# Altium schematic sheet Transistor_LED.SchDoc: LED with Transistor
size 203 x 127 mm; Author: Kace Chandler; DrawnBy: Kace Chandler; DocumentNumber: 21; Revision: 1; SheetNumber: 21; SheetTotal: 23
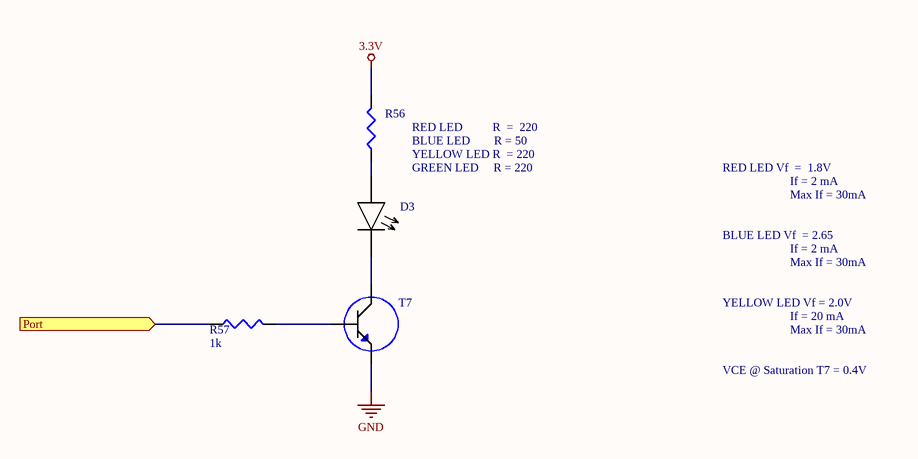
[diagram p0: Transistor_LED.SchDoc]

## Parts
D3  LED_R  [0402 footprint]  (value not drawn)
R56  Res3  (value not drawn)
R57  value 1k  (hidden comment: Res3)
T7  MMBT2222ALT1  [BJT]  (value not drawn)

## Ports
Port (in)

## Nets
3.3V: R56.2
GND: T7.2(E)
Port: R57.1 ; port Port
NetD3_1: D3.1 R56.1
NetD3_2: D3.2 T7.3(C)
NetR57_2: R57.2 T7.1(B)

## Notes on the sheet
- (near R56) RED LED          R  =  220
- (near R56) BLUE LED        R = 50
- YELLOW LED R  = 220
- GREEN LED     R = 220
- RED LED Vf  =  1.8V
- If = 2 mA
- Max If = 30mA
- BLUE LED Vf  = 2.65
- YELLOW LED Vf = 2.0V
- If = 20 mA
- VCE @ Saturation T7 = 0.4V

## Library data of the parts
R56 = Res3: Resistor; Value: Depends on the color of the LED; Published: 8-Jun-2000; LatestRevisionDate: 29-May-2009; LatestRevisionNote: IPC-7351 Footprint Added.; PackageReference: J1-0603; Publisher: Altium Limited; PackageDescription: Chip Resistor
R57 = Res3: Resistor; Published: 8-Jun-2000; LatestRevisionDate: 29-May-2009; LatestRevisionNote: IPC-7351 Footprint Added.; PackageReference: J1-0603; Publisher: Altium Limited; PackageDescription: Chip Resistor
T7 = BJT NPN: Trans NPN 40V 0.6A SOT23; MF: ON Semiconductor; SnapEDA_Link: https://www.snapeda.com/parts/MMBT2222ALT1/ON%20Semiconductor/view-part/?ref=snap; Price: None; Availability: Unavailable; MP: MMBT2222ALT1; Package: SOT-23 Motorola; Value: *; Supplier 1: Digi-Key; Supplier Part Number 1: MMBT2222ATPMSCT-ND
D3 = LED_R: Supplier 1: Digi-Key; Supplier Part Number 1: 754-2123-1-ND